# Altium schematic sheet Flash Memory.SchDoc: Flash Memory
size A4; Date: Dec. 26th, 2022; Author: Karl Asseily; DrawnBy: Karl Asseily; DocumentNumber: 202301140903; Revision: 1.2; SheetNumber: 13; SheetTotal: 20
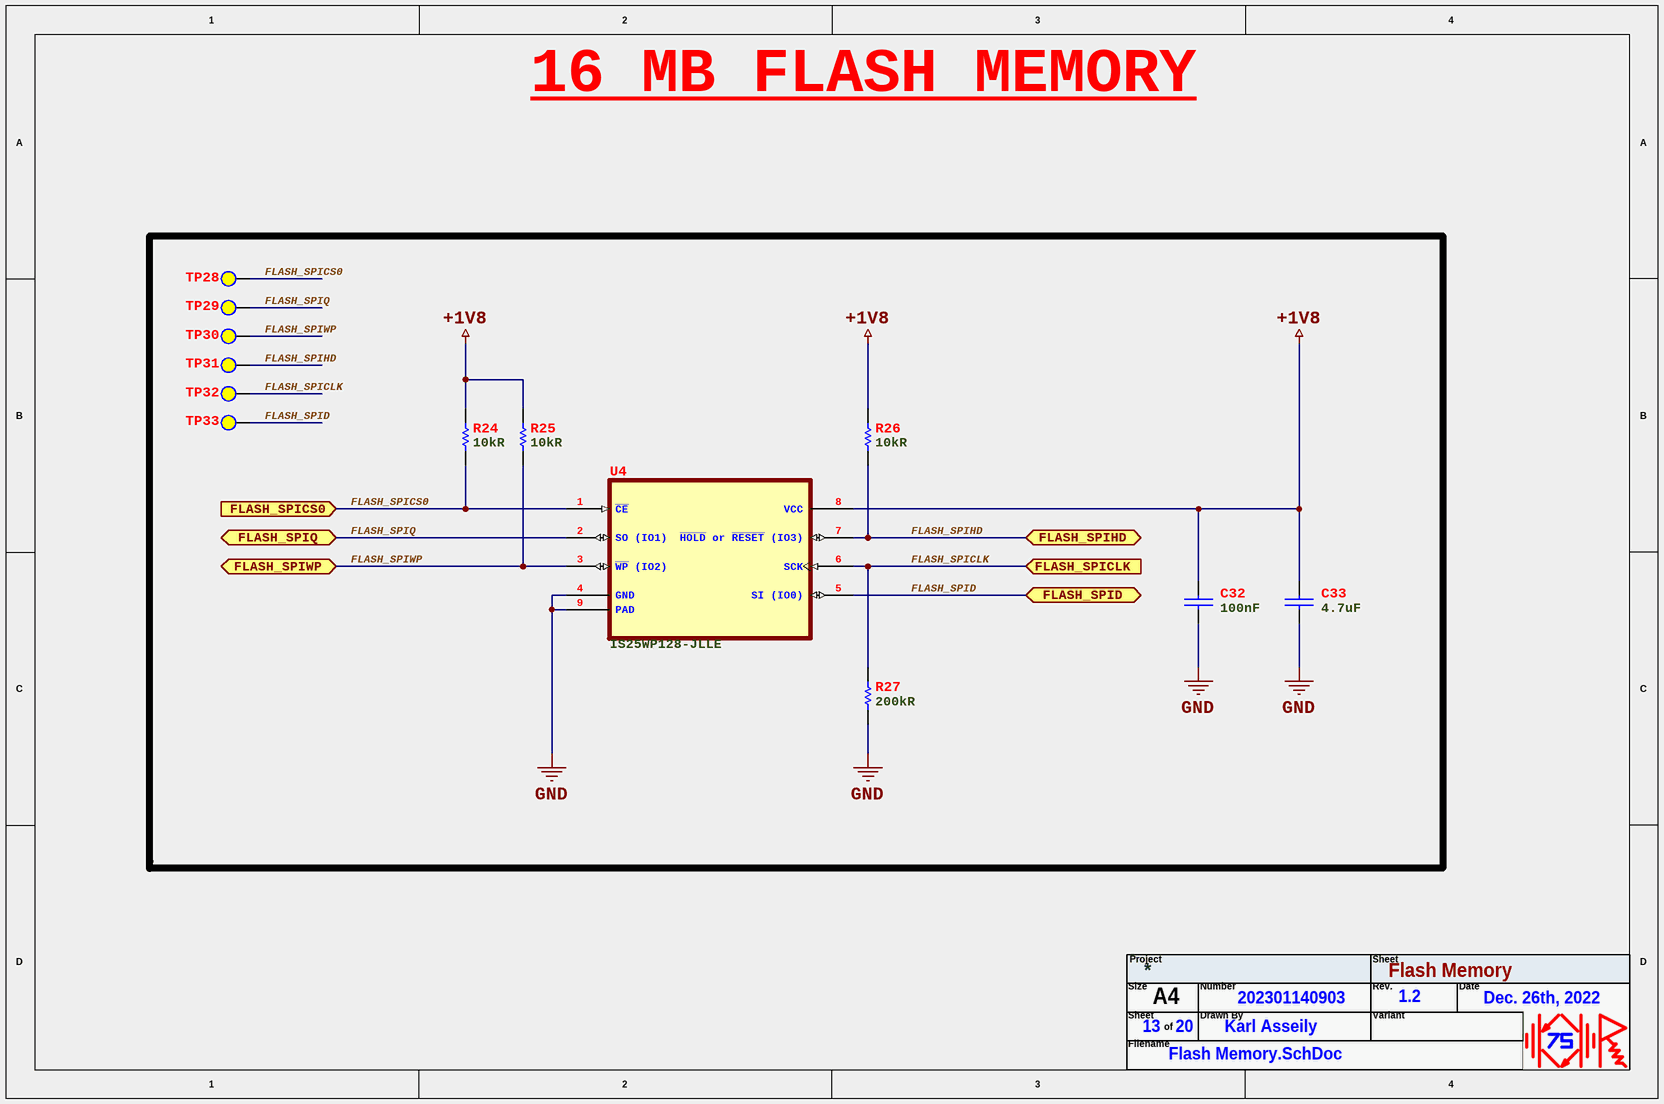
[diagram p0: Flash Memory.SchDoc]

## Parts
C32  100nF  [CAP_0603]
C33  4.7uF  [CAP_0805]
R24  10kR  [RES_0603]
R25  10kR  [RES_0603]
R26  10kR  [RES_0603]
R27  200kR  [RES_0603]
TP28  SPICS0  [TEST POINT PAD]  (value not drawn)  (no BOM)
TP29  SPIQ  [TEST POINT PAD]  (value not drawn)  (no BOM)
TP30  SPIWP  [TEST POINT PAD]  (value not drawn)  (no BOM)
TP31  SPIHD  [TEST POINT PAD]  (value not drawn)  (no BOM)
TP32  SPICLK  [TEST POINT PAD]  (value not drawn)  (no BOM)
TP33  SPID  [TEST POINT PAD]  (value not drawn)  (no BOM)
U4  IS25WP128-JLLE  [IC_SON127P800X600X80-9N]

## Ports
FLASH_SPICLK (in, see Main Controller Unit, ESP32 Processor), FLASH_SPICS0 (in, see Main Controller Unit, ESP32 Processor), FLASH_SPID (bidir, see Main Controller Unit, ESP32 Processor), FLASH_SPIHD (bidir, see Main Controller Unit, ESP32 Processor), FLASH_SPIQ (bidir, see Main Controller Unit, ESP32 Processor), FLASH_SPIWP (bidir, see Main Controller Unit, ESP32 Processor)

## Nets
+1V8: C32.1 C33.1 R24.2 R25.2 R26.2 U4.8(VCC)
GND: C32.2 C33.2 R27.2 U4.4(GND) U4.9(PAD)
FLASH_SPICLK: R27.1 TP32.TP U4.6(SCK) ; port FLASH_SPICLK
FLASH_SPICS0: R24.1 TP28.TP U4.1(~{CE}) ; port FLASH_SPICS0
FLASH_SPID: TP33.TP U4.5(SI_(IO0)) ; port FLASH_SPID
FLASH_SPIHD: R26.1 TP31.TP U4.7(~{HOLD}_or_~{RESET}_(IO3)) ; port FLASH_SPIHD
FLASH_SPIQ: TP29.TP U4.2(SO_(IO1)) ; port FLASH_SPIQ
FLASH_SPIWP: R25.1 TP30.TP U4.3(~{WP}_(IO2)) ; port FLASH_SPIWP

## Notes on the sheet
- 16 MB FLASH MEMORY
- Project
- Sheet
- Size
- Filename
- A4
- of
- Number
- Drawn By
- Rev.
- Variant
- Date

## Library data of the parts
C32 = CAP_0.1uF-50V-10%_0603: 0.1 µF ±10% 50V Ceramic Capacitor X7R 0603 (1608 Metric); Manufacturer: Yageo; Manufacturer Part Number: CC0603KRX7R9BB104; Supplier 1: Digi-Key; RoHS: Yes; Category: Ceramic Capacitors; Stock 1: 10054527; Pricing 1: 1=0.10000, 10=0.05400, 50=0.02960, 100=0.02430, 500=0.01732, 1000=0.01361 (USD); Mounting Technology: Surface Mount; Case/Package: 0603; Pins: 2; Case Code (Metric): 1608; Case Code (Imperial): 0603; Dielectric Material: Ceramic; Min Operating Temperature: -55°C; Max Operating Temperature: 125°C; Package Quantity: 1; Capacitance: 100nF; Voltage Rating: 50V; Tolerance: 10%; Packaging: Tape and Reel; Dielectric: X7R; Termination: SMD/SMT; Voltage: 50V; Series: CC; Length: 0.063inch; Width: 0.031inch; Height: 0.8mm; Thickness: 0.035inch; Depth: 0.8mm; Radiation Hardening: No; Reach SVHC Compliant: Yes; Lead Free: Lead Free; Halogen Free: Halogen Free; RoHS Compliant: Yes; ComponentLink1URL: C:\Users\Public\Documents\Altium\Projects\Cellar_Watchdog\Docs\Capacitor\UPY-GPHC_X7R_6.3V-to-250V_22.pdf; ComponentLink1Description: Datasheet; Supplier Part Number 2: 603-CC603KRX7R9BB104; Supplier Part Number 1: 311-1344-1-ND; Supplier 2: Mouser
C33 = CAP_4.7uF-25V-10%_0805: 4.7 µF ±10% 25V Ceramic Capacitor X7R 0805 (2012 Metric); Manufacturer: Yageo; Manufacturer Part Number: CC0805KKX7R8BB475; Supplier 1: Digi-Key; RoHS: Yes; Category: Ceramic Capacitors; Stock 1: 26099; Pricing 1: 1=0.39000, 10=0.27000, 50=0.18940, 100=0.16230, 500=0.12172, 1000=0.10278 (USD); Mounting Technology: Surface Mount; Case/Package: 0805; Case Code (Metric): 2012; Case Code (Imperial): 0805; Weight: 0.000194oz; Min Operating Temperature: -55°C; Max Operating Temperature: 125°C; Packaging: Tape and Reel; Capacitance: 4.7uF; Voltage Rating: 25V; Tolerance: 10%; Dielectric: X7R; Termination: SMD/SMT; Voltage Rating (DC): 25V; Package Quantity: 3000; Length: 0.079inch; Width: 0.049inch; Thickness: 0.057inch; Lead Free: Lead Free; Halogen Free: Halogen Free; RoHS Compliant: Yes; ComponentLink1URL: C:\Users\Public\Documents\Altium\Projects\Cellar_Watchdog\Docs\Capacitor\UPY-GP_NP0_16V-to-50V_18.pdf; ComponentLink1Description: Datasheet; Supplier 2: Mouser; Supplier Part Number 1: 311-1885-1-ND; Supplier Part Number 2: 603-CC805KKX7R8BB475
R24-R26 = RES_10kR-100mW-1%_0603: 10 kOhms ±1% 0.1W, 1/10W Chip Resistor 0603 (1608 Metric) Moisture Resistant Thick Film; Manufacturer: Yageo; Manufacturer Part Number: RC0603FR-0710KL; Temperature Coefficient: 100ppm/°C; Voltage Rating (DC): 50V; Power Rating: 100mW; Voltage Rating: 75V; Supplier 1: Digi-Key; RoHS: Yes; Category: Chip SMD Resistors; Stock 1: 43209622; Pricing 1: 1=0.10000, 10=0.02100, 100=0.00850, 1000=0.00383, 2500=0.00332 (USD); Case/Package: 0603; Pins: 2; Case Code (Imperial): 0603; Case Code (Metric): 1608; Weight: 7.1E-05oz; Min Operating Temperature: -55°C; Max Operating Temperature: 155°C; Tolerance: 1%; Resistor Type: Thick Film; Resistance: 10kR; Packaging: Tape and Reel; Termination: SMD/SMT; Features: Moisture Resistant; Series: RC; Max Power Dissipation: 100mW; Number of Terminations: 2; Resistance Tolerance: 1%; Construction: Rectangular; Length: 1.6mm; Width: 0.8mm; Height: 0.45mm; Depth: 0.8mm; Lead Pitch: 0.3mm; Reach SVHC Compliant: Yes; Lead Free: Lead Free; Military Standard: Not; RoHS Compliant: Yes; ComponentLink6URL: C:\Users\Public\Documents\Altium\Projects\Cellar_Watchdog\Docs\Resistor\PYu-RC_Group_51_RoHS_L_12.pdf; ComponentLink6Description: Datasheet; Supplier 2: Mouser; Supplier Part Number 1: 311-10.0KHRCT-ND; Supplier Part Number 2: 603-RC0603FR-0710KL
R27 = RES_200kR-100mW-1%_0603: 200 kOhms ±1% 0.1W, 1/10W Chip Resistor 0603 (1608 Metric) Moisture Resistant Thick Film; Manufacturer: Yageo; Manufacturer Part Number: RC0603FR-07200KL; Temperature Coefficient: 100ppm/°C; Voltage Rating (DC): 50V; Power Rating: 100mW; Supplier 1: Digi-Key; RoHS: Yes; Category: Chip SMD Resistors; Stock 1: 2519717; Pricing 1: 1=0.10000, 10=0.02100, 100=0.00850, 1000=0.00383, 2500=0.00332 (USD); Case/Package: 0603; Pins: 2; Case Code (Metric): 1608; Case Code (Imperial): 0603; Min Operating Temperature: -55°C; Max Operating Temperature: 155°C; Resistance: 200kR; Tolerance: 1%; Packaging: Tape and Reel; Resistor Type: Thick Film; Voltage Rating: 50V; Package Quantity: 1; Number of Terminations: 2; Termination: SMD/SMT; Max Power Dissipation: 100mW; Features: Moisture Resistant; Series: RC; Resistance Tolerance: 1%; Construction: Rectangular; Length: 0.063inch; Width: 0.031inch; Height: 0.022inch; Depth: 0.8mm; Lead Free: Lead Free; Reach SVHC Compliant: Yes; Military Standard: Not; RoHS Compliant: Yes; ComponentLink1URL: C:\Users\Public\Documents\Altium\Projects\Cellar_Watchdog\Docs\Resistor\PYu-RC_Group_51_RoHS_L_12.pdf; ComponentLink1Description: Datasheet; Supplier 2: Mouser; Supplier Part Number 1: 311-200KHRCT-ND; Supplier Part Number 2: 603-RC0603FR-07200KL
TP28-TP33 = Test Point: PCB Test Point; ClassName: Test Point
  TP28: Value: SPICS0
  TP29: Value: SPIQ
  TP30: Value: SPIWP
  TP31: Value: SPIHD
  TP32: Value: SPICLK
  TP33: Value: SPID
U4 = IC_IS25WP128-JLLE: NOR Flash Serial (SPI, Dual SPI, Quad SPI) 1.8V 128M-bit 16M x 8 8ns 8-Pin WSON EP; Manufacturer: ISSI; Density: 128Mb; Address Bus Width: 24b; Interface: SPI,Serial; Page Size: 256B; Supplier 1: Digi-Key; Manufacturer Part Number: IS25WP128-JLLE; RoHS: Yes; Category: Memory; Stock 1: 11963; Pricing 1: 1=3.00000, 10=2.69300, 25=2.65120, 40=2.64425, 80=2.36275, 230=2.28513, 480=2.27679, 960=2.12010 (USD); Number of Pins: 8; Min Operating Temperature: -40°C; Max Operating Temperature: 105°C; Memory Type: NOR; Operating Supply Voltage: 1.8V; RoHS Compliant: Yes; Supplier 2: Mouser; Supplier Part Number 1: 706-1625-ND; Supplier Part Number 2: 870-25WP128-JLLE; ComponentLink6Description: Datasheet; ComponentLink6URL: C:\Users\Public\Documents\Altium\Projects\Cellar_Watchdog\Docs\Memory\IS25WP032-064-128.pdf; ComponentLink7Description: Design Guideline (Micron); ComponentLink7URL: C:\Users\Public\Documents\Altium\Projects\Cellar_Watchdog\Docs\Memory\tn2509_layout_guidelines_spi_nor_mt25q.pdf